# EAGLE design Ampli-Mic (EAGLE 7.6.0)
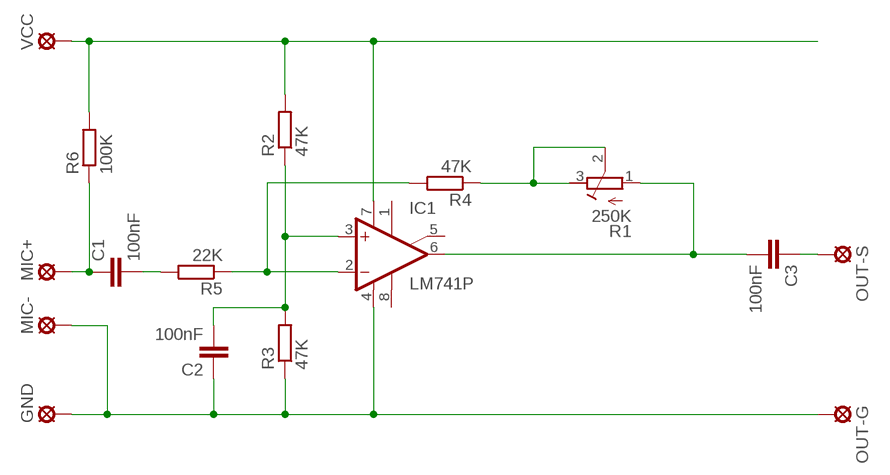
[diagram p0: schematic, sheet 1]

## Parts
C1  100nF  C-EU050-024X044  [C050-024X044]
C2  100nF  C-EU050-024X044  [C050-024X044]
C3  100nF  C-EU050-024X044  [C050-024X044]
GND  LSP10  [LSP10]
IC1  LM741P  [DIL08]
MIC+  LSP10  [LSP10]
MIC-  LSP10  [LSP10]
OUT-G  LSP10  [LSP10]
OUT-S  LSP10  [LSP10]
R1  250K  R-TRIMM3339P  [RTRIM3339P]
R2  47K  R-EU_0207/10  [0207/10]
R3  47K  R-EU_0207/10  [0207/10]
R4  47K  R-EU_0207/10  [0207/10]
R5  22K  R-EU_0207/10  [0207/10]
R6  100K  R-EU_0207/10  [0207/10]
VCC  LSP10  [LSP10]

## Nets
N$1: C2.1 GND.MP IC1.4(V-) MIC-.MP OUT-G.MP R3.1
N$2: IC1.7(V+) R2.2 R6.2 VCC.MP
N$3: C2.2 IC1.3(+IN) R2.1 R3.2
N$4: IC1.2(-IN) R4.2 R5.1
N$5: R1.2(S) R1.3(E) R4.1
N$7: C3.1 OUT-S.MP
N$8: C3.2 IC1.6(OUT) R1.1(A)
N$10: C1.2 R5.2
N$11: C1.1 MIC+.MP R6.1
Unconnected: IC1.1(ON1) IC1.5(ON2) IC1.8(OPT)

## Library data of the parts
C1-C3 = rcl:C-EU: CAPACITOR, European symbol
GND MIC+ MIC- OUT-G OUT-S VCC = solpad:LSP10: SOLDER PAD drill 1.0 mm, distributor Buerklin, 12H555
IC1 = linear:*741: OP AMP
R1 = rcl:R-TRIMM: Trimm resistor
R2-R6 = rcl:R-EU_: RESISTOR, European symbol

## Board
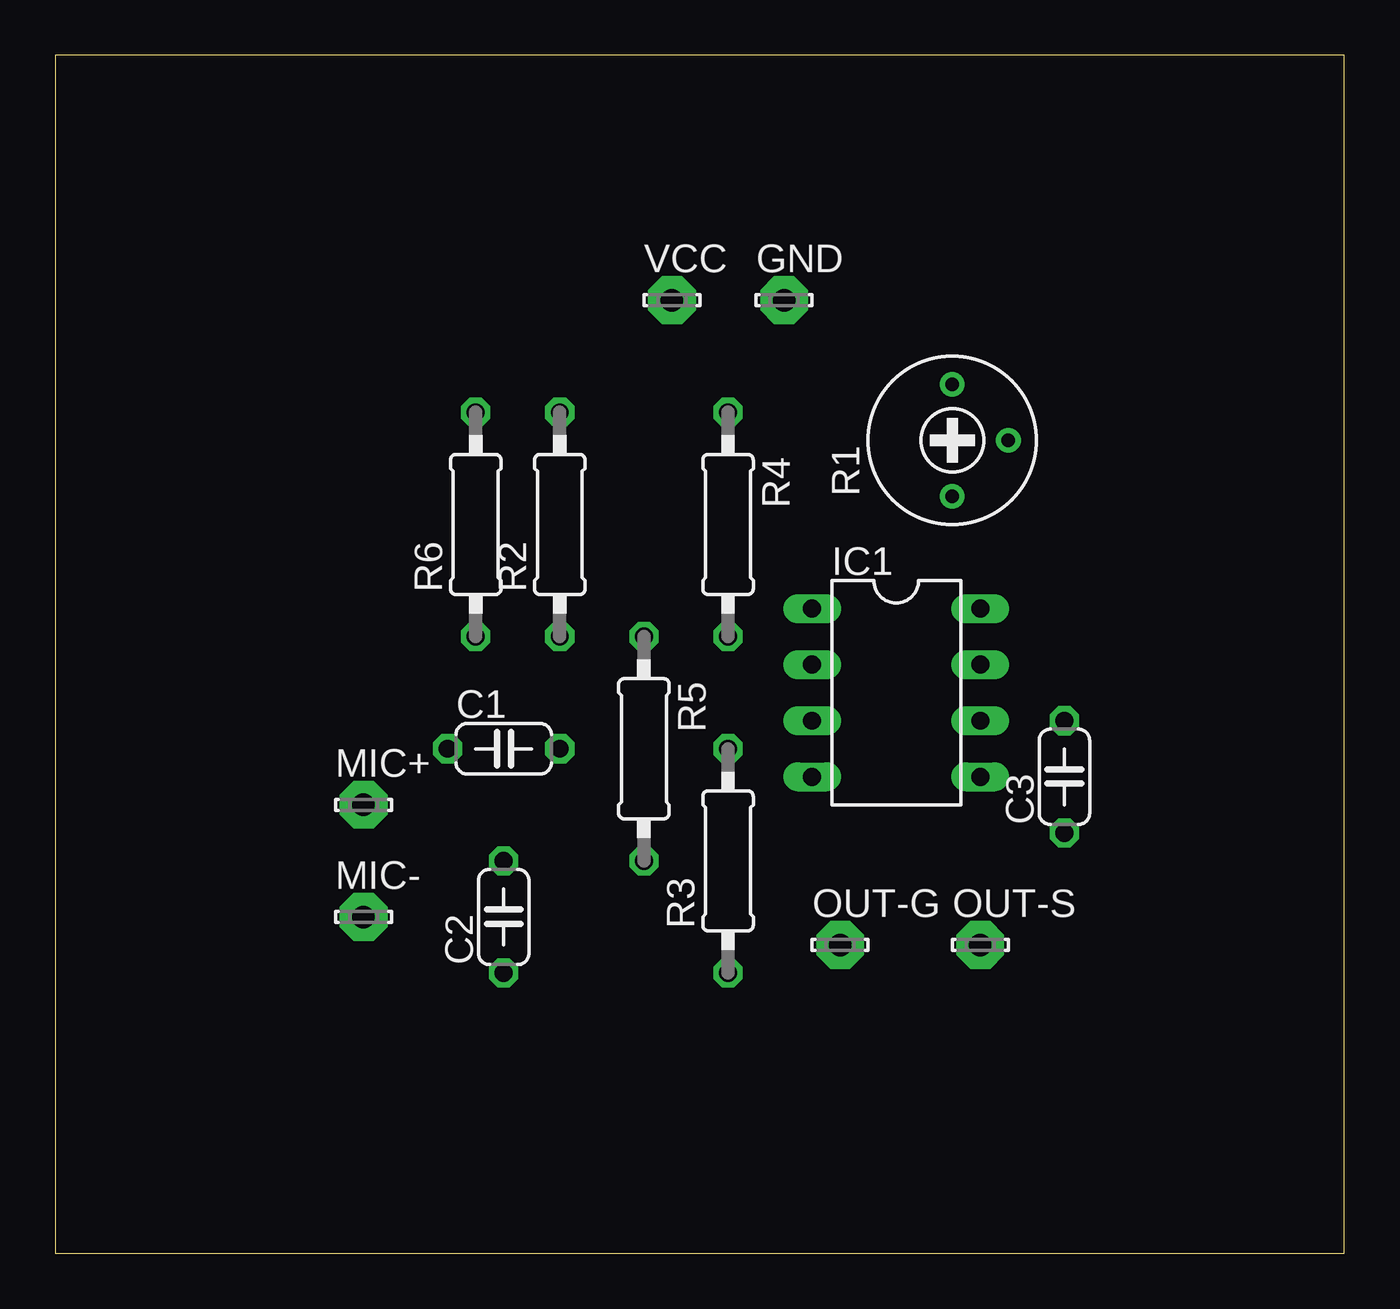
[diagram p1: board, top side]
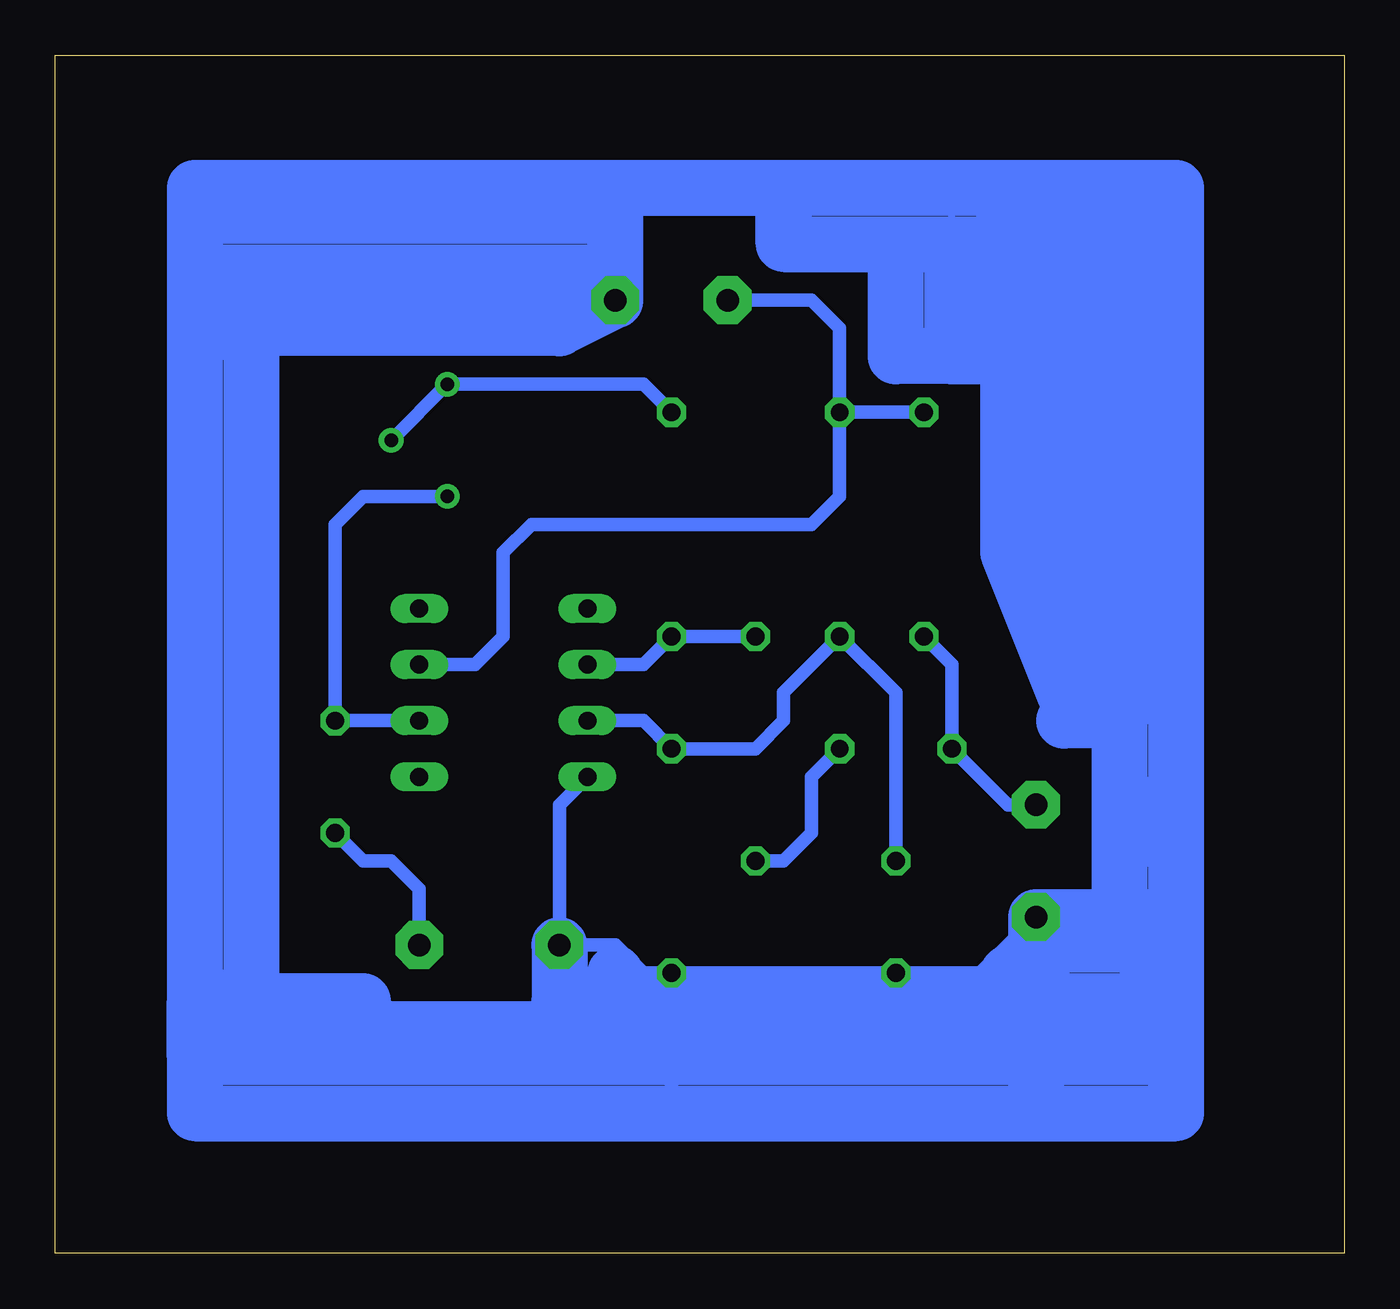
[diagram p2: board, bottom side, seen from below]

Size 58.4 x 54.28 mm. Coordinates in mm from the lower left corner, seen from the top.
Outline: 0,0 58.4,0 58.4,54.28 0,54.28 0,0
Copper layers (1*16): Top 0.035mm / dielectric 1.5mm / Bottom 0.035mm
Design rules "default": minimum track width 10mil, minimum drill 24mil, track to track 8mil, track to pad 8mil, pad to pad 8mil, via to via 8mil, smd to smd 8mil, copper to edge 40mil, drill to drill 8mil, minimum pad ring 10mil, minimum via ring 8mil, stop-mask expansion 4mil, vias tented up to drill 0mil, thermal gap 10mil

### Footprints (pad centres in the part's own frame; a part is rotated, then mirrored left to right if it is on the bottom)
C050-024X044 = drill 0.813 octagon: 1 -2.54,0; 2 2.54,0
LSP10 = drill 1.016 pad 2.159 octagon: MP 0,0
DIL08 = drill 0.813 pad 1.27 long: 1 -3.81,-3.81; 2 -1.27,-3.81; 3 1.27,-3.81; 4 3.81,-3.81; 5 3.81,3.81; 6 1.27,3.81; 7 -1.27,3.81; 8 -3.81,3.81
RTRIM3339P = drill 0.61: 1 -2.54,0; 2 0,-2.54; 3 2.54,0
0207/10 = drill 0.813 octagon: 1 -5.08,0; 2 5.08,0

### Placement (x,y rotation side)
C1  20.32,22.86 0 top
C2  20.32,15.24 90 top
C3  45.72,21.59 90 top
GND  33.02,43.18 0 top
IC1  38.1,25.4 270 top
MIC+  13.97,20.32 0 top
MIC-  13.97,15.24 0 top
OUT-G  35.56,13.97 0 top
OUT-S  41.91,13.97 0 top
R1  40.64,36.83 90 top
R2  22.86,33.02 90 top
R3  30.48,17.78 90 top
R4  30.48,33.02 270 top
R5  26.67,22.86 270 top
R6  19.05,33.02 90 top
VCC  27.94,43.18 0 top

### Tracks (layer width: path | path; a pad name or v marks a point on that pad's centre or on a via)
N$1
  Bottom 0.61: MIC-.MP 16.51,12.7 C2.1 R3.1 | R3.1 31.75,12.7 33.02,13.97 OUT-G.MP 35.56,20.32 IC1.4 | R3.1 30.48,6.35
  Bottom 2.54: 33.02,48.26 52.07,48.26 52.07,44.45 | 52.07,44.45 52.07,41.91 | 52.07,41.91 52.07,11.43 | 52.07,8.89 52.07,6.35 30.48,6.35 13.97,6.35 | 13.97,6.35 7.62,6.35 7.62,15.24 | 7.62,15.24 7.62,48.26 33.02,48.26 | 33.02,48.26 GND.MP 35.56,41.91 52.07,41.91 | 10.16,15.24 MIC-.MP 13.97,6.35 | 10.16,15.24 7.62,15.24 | 8.89,8.89 33.02,8.89 | 33.02,8.89 52.07,8.89 | 52.07,8.89 52.07,11.43 | 52.07,11.43 44.45,11.43 44.45,10.16 35.56,10.16 | 34.29,10.16 35.56,10.16 | 35.56,10.16 35.56,11.43 | OUT-G.MP 35.56,11.43 | 35.56,11.43 8.89,11.43 8.89,13.97 12.7,13.97 15.24,12.7 | 33.02,8.89 33.02,12.7 | 10.16,15.24 10.16,17.78 | 10.16,17.78 8.89,20.32 | 10.16,46.99 10.16,24.13 | 10.16,17.78 10.16,24.13 | 10.16,24.13 12.7,24.13 | 52.07,44.45 34.29,44.45
N$2
  Bottom 0.61: R6.2 R2.2 | R2.2 22.86,41.91 24.13,43.18 VCC.MP | IC1.7 39.37,26.67 38.1,27.94 38.1,31.75 36.83,33.02 24.13,33.02 22.86,34.29 R2.2
N$3
  Bottom 0.61: C2.2 20.32,25.4 R2.1 25.4,25.4 25.4,24.13 26.67,22.86 R3.2 31.75,24.13 IC1.3
N$4
  Bottom 0.61: R5.1 R4.2 31.75,26.67 IC1.2
N$5
  Bottom 0.61: R1.2 R1.3 31.75,39.37 R4.1
N$7
  Bottom 0.61: OUT-S.MP 41.91,16.51 43.18,17.78 44.45,17.78 C3.1
N$8
  Bottom 0.61: IC1.6 C3.2 45.72,33.02 44.45,34.29 R1.1
N$10
  Bottom 0.61: C1.2 24.13,21.59 24.13,19.05 25.4,17.78 R5.2
N$11
  Bottom 0.61: MIC+.MP 15.24,20.32 C1.1 17.78,26.67 R6.1
N$12
  Bottom 2.54: 15.24,46.99 15.24,31.75 12.7,25.4 12.7,46.99
N$13
  Bottom 2.54: 17.78,45.72 25.4,45.72 25.4,46.99 | 17.78,45.72 16.51,45.72 | 17.78,45.72 17.78,40.64 | 17.78,40.64 16.51,40.64 | 17.78,40.64 20.32,40.64 20.32,44.45
N$15
  Bottom 2.54: 34.29,46.99 50.8,46.99
N$16
  Bottom 2.54: 49.53,40.64 49.53,12.7